# Altium project rcm3dev.PrjPCB
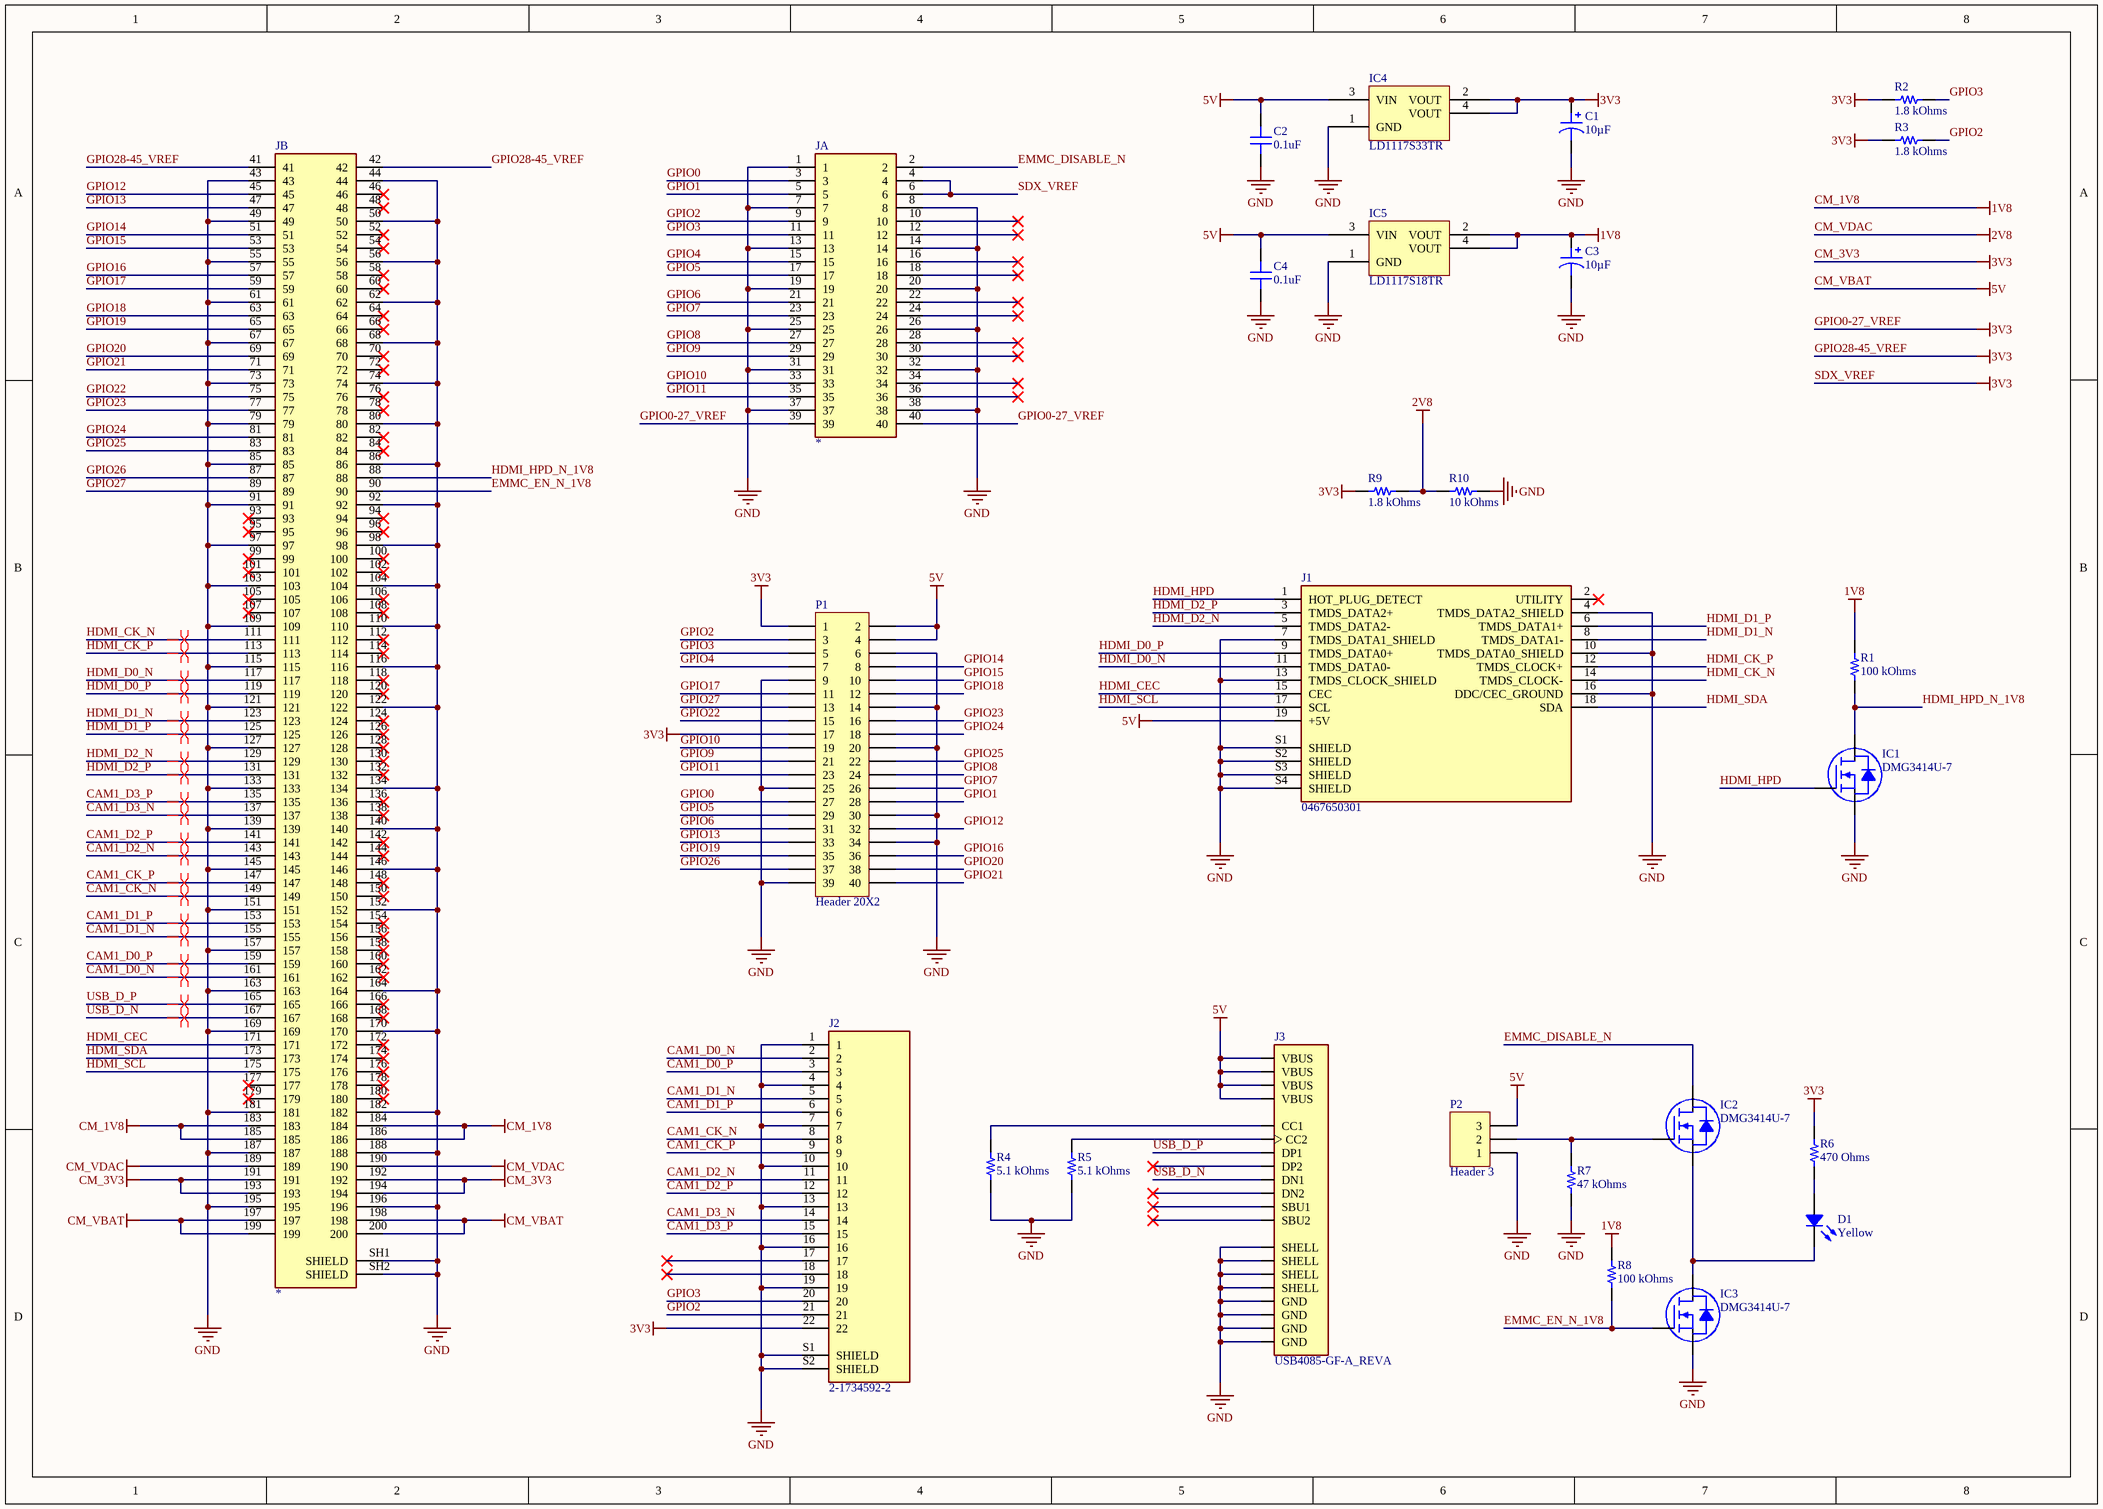
[diagram p0: Sheet.SchDoc]
1 sheet, 26 parts. Net scope: global (net labels, ports and power ports of the same name join across sheets).
Board file: PCB.PcbDoc

## Sheet Sheet.SchDoc
size A3

### Parts
C1  10µF  [CAP POL 1206_3216]
C2  0.1uF  [CAP 0603_1608]
C3  10µF  [CAP POL 1206_3216]
C4  0.1uF  [CAP 0603_1608]
D1  Yellow  [LED 0603_1608 YELLOW]
IC1  DMG3414U-7  [DIODES SOT-23-3]
IC2  DMG3414U-7  [DIODES SOT-23-3]
IC3  DMG3414U-7  [DIODES SOT-23-3]
IC4  LD1117S33TR  [ST SOT-223]
IC5  LD1117S18TR  [ST SOT-223]
J  1473149-4  [TE_1473149-4]  (value not drawn)  (parts A,B of 2)
J1  0467650301  [MOLEX_0467650301]
J2  2-1734592-2  [TE_2-1734592-2]
J3  USB4085-GF-A_REVA  [GCT_USB4085-GF-A_REVA]
P1  Header 20X2  [HDR2X20]
P2  Header 3  [HDR1X3]
R1  100 kOhms  [RES 0603_1608]
R2  1.8 kOhms  [RES 0603_1608]
R3  1.8 kOhms  [RES 0603_1608]
R4  5.1 kOhms  [RES 0603_1608]
R5  5.1 kOhms  [RES 0603_1608]
R6  470 Ohms  [RES 0603_1608]
R7  47 kOhms  [RES 0603_1608]
R8  100 kOhms  [RES 0603_1608]
R9  1.8 kOhms  [RES 0603_1608]
R10  10 kOhms  [RES 0603_1608]

### Nets
CM_1V8: C3.1 IC5.2(VOUT) IC5.4(VOUT) J.183 J.184 J.185 J.186 R1.2 R8.2  [also labelled 1V8]
CM_3V3: C1.1 IC4.2(VOUT) IC4.4(VOUT) J.4 J.6 J.39 J.40 J.41 J.42 J.191 J.192 J.193 J.194 J2.22 P1.1 P1.17 R2.1 R3.1 R6.2 R9.2  [also labelled 3V3, GPIO0-27_VREF, GPIO28-45_VREF, SDX_VREF]
CM_VBAT: C2.2 C4.2 IC4.3(VIN) IC5.3(VIN) J.197 J.198 J.199 J.200 J1.19(+5V) J3.A4(VBUS) J3.A9(VBUS) J3.B4(VBUS) J3.B9(VBUS) P1.2 P1.4 P2.3  [also labelled 5V]
CM_VDAC: J.189 J.190 R9.1 R10.2  [also labelled 2V8]
GND: C1.2 C2.1 C3.2 C4.1 IC1.2(S) IC3.2(S) IC4.1(GND) IC5.1(GND) J.1 J.7 J.8 J.13 J.14 J.19 J.20 J.25 J.26 J.31 J.32 J.37 J.38 J.43 J.44 J.49 J.50 J.55 J.56 J.61 J.62 J.67 J.68 J.73 J.74 J.79 J.80 J.85 J.86 J.91 J.92 J.97 J.98 J.103 J.104 J.109 J.110 J.115 J.116 J.121 J.122 J.127 J.133 J.134 J.139 J.140 J.145 J.146 J.151 J.152 J.157 J.163 J.164 J.169 J.170 J.181 J.182 J.187 J.188 J.195 J.196 J.SH1(SHIELD) J.SH2(SHIELD) J1.4(TMDS_DATA2_SHIELD) J1.7(TMDS_DATA1_SHIELD) J1.10(TMDS_DATA0_SHIELD) J1.13(TMDS_CLOCK_SHIELD) J1.16(DDC/CEC_GROUND) J1.S1(SHIELD) J1.S2(SHIELD) J1.S3(SHIELD) J1.S4(SHIELD) J2.1 J2.4 J2.7 J2.10 J2.13 J2.16 J2.19 J2.S1(SHIELD) J2.S2(SHIELD) J3.A1(GND) J3.A12(GND) J3.B1(GND) J3.B12(GND) J3.P1(SHELL) J3.P2(SHELL) J3.P3(SHELL) J3.P4(SHELL) P1.6 P1.9 P1.14 P1.20 P1.25 P1.30 P1.34 P1.39 P2.1 R4.1 R5.1 R7.1 R10.1
CAM1_CK_N: J.149 J2.8
CAM1_CK_P: J.147 J2.9
CAM1_D0_N: J.161 J2.2
CAM1_D0_P: J.159 J2.3
CAM1_D1_N: J.155 J2.5
CAM1_D1_P: J.153 J2.6
CAM1_D2_N: J.143 J2.11
CAM1_D2_P: J.141 J2.12
CAM1_D3_N: J.137 J2.14
CAM1_D3_P: J.135 J2.15
EMMC_DISABLE_N: IC2.3(D) J.2
EMMC_EN_N_1V8: IC3.1(G) J.90 R8.1
GPIO0: J.3 P1.27
GPIO1: J.5 P1.28
GPIO2: J.9 J2.21 P1.3 R3.2
GPIO3: J.11 J2.20 P1.5 R2.2
GPIO4: J.15 P1.7
GPIO5: J.17 P1.29
GPIO6: J.21 P1.31
GPIO7: J.23 P1.26
GPIO8: J.27 P1.24
GPIO9: J.29 P1.21
GPIO10: J.33 P1.19
GPIO11: J.35 P1.23
GPIO12: J.45 P1.32
GPIO13: J.47 P1.33
GPIO14: J.51 P1.8
GPIO15: J.53 P1.10
GPIO16: J.57 P1.36
GPIO17: J.59 P1.11
GPIO18: J.63 P1.12
GPIO19: J.65 P1.35
GPIO20: J.69 P1.38
GPIO21: J.71 P1.40
GPIO22: J.75 P1.15
GPIO23: J.77 P1.16
GPIO24: J.81 P1.18
GPIO25: J.83 P1.22
GPIO26: J.87 P1.37
GPIO27: J.89 P1.13
HDMI_CEC: J.171 J1.15(CEC)
HDMI_CK_N: J.111 J1.14(TMDS_CLOCK-)
HDMI_CK_P: J.113 J1.12(TMDS_CLOCK+)
HDMI_D0_N: J.117 J1.11(TMDS_DATA0-)
HDMI_D0_P: J.119 J1.9(TMDS_DATA0+)
HDMI_D1_N: J.123 J1.8(TMDS_DATA1-)
HDMI_D1_P: J.125 J1.6(TMDS_DATA1+)
HDMI_D2_N: J.129 J1.5(TMDS_DATA2-)
HDMI_D2_P: J.131 J1.3(TMDS_DATA2+)
HDMI_HPD: IC1.1(G) J1.1(HOT_PLUG_DETECT)
HDMI_HPD_N_1V8: IC1.3(D) J.88 R1.1
HDMI_SCL: J.175 J1.17(SCL)
HDMI_SDA: J.173 J1.18(SDA)
USB_D_N: J.167 J3.A7(DN1)
USB_D_P: J.165 J3.A6(DP1)
NetD1_1: D1.1 R6.1
NetD1_2: D1.2 IC2.2(S) IC3.3(D)
NetIC2_1: IC2.1(G) P2.2 R7.2
NetJ3_A5: J3.A5(CC1) R4.2
NetJ3_B5: J3.B5(CC2) R5.2

Not connected (* = marked no-connect by the designer): J 10* 12* 16* 18* 22* 24* 28* 30* 34* 36* 46* 48* 52* 54* 58* 60* 64* 66* 70* 72* 76* 78* 82* 84* 93* 94* 95* 96* 99* 100* 101* 102* 105* 106* 107* 108* 112* 114* 118* 120* 124* 126* 128* 130* 132* 136* 138* 142* 144* 148* 150* 154* 156* 158* 160* 162* 166* 168* 172* 174* 176* 177* 178* 179* 180*; J1 2(UTILITY)*; J2 17* 18*; J3 A8(SBU1)* B6(DP2)* B7(DN2)* B8(SBU2)*

### Layout directives
differential pair: CAM1_CK_N, CAM1_CK_P, CAM1_D0_N, CAM1_D0_P, CAM1_D1_N, CAM1_D1_P, CAM1_D2_N, CAM1_D2_P, CAM1_D3_N, CAM1_D3_P, HDMI_CK_N, HDMI_CK_P, HDMI_D0_N, HDMI_D0_P, HDMI_D1_N, HDMI_D1_P, HDMI_D2_N, HDMI_D2_P, USB_D_N, USB_D_P

### Library data of the parts
C1 C3 = TR3A475K020C1800: CAP TANT 4.7UF 10% 20V 1206; Manufacturer: Vishay Sprague; Manufacturer Size Code: A; Capacitance: 4.7µF; ESR (Equivalent Series Resistance): 1.8Ohm; Type: Molded; Part Number: TR3A475K020C1800; Value: 10µF; ComponentLink1Description: Datasheet; ComponentLink1URL: http://www.vishay.com/docs/40080/tr3.pdf; ComponentLink2Description: DigiKey Link; ComponentLink2URL: http://digikey.com/product-detail/en/vishay-sprague/TR3A475K020C1800/718-1830-1-ND/2259990; Device Package: 1206 (3216 Metric); Features: General Purpose; Height - Seated (Max): 0.071" (1.80mm); LastUpdated: 02-09-2020 1.15.59 AM; Lifecycle Status: Active; Minimum Order: 1; Mounting Type: Surface Mount; Operating Temperature: -55°C ~ 125°C; Package / Case: 1206 (3216 Metric); Packaging: TapeAndReel; PartId: 139; Part Status: Active; Price: 0.35; Series: TANTAMOUNT®, TR3; Size / Dimension: 0.126" L x 0.063" W (3.20mm x 1.60mm); Supplier 1: DigiKey; Supplier Part Number 1: 718-1830-1-ND; Tolerance: ±10%; Voltage - Rated: 20V
C2 C4 = CC0603KRX7RABB102: CAP CER 0.1uF 200V X7R 0603; Manufacturer: Yageo; Capacitance: 1000pF; Tolerance: ±10%; Part Number: CC0603KRX7RABB102; Value: 0.1uF; Applications: General Purpose; ComponentLink1Description: Datasheet; ComponentLink1URL: http://www.yageo.com/documents/recent/UPY-NP0X7R_MV_100-to-630V_21.pdf; ComponentLink2Description: DigiKey Link; ComponentLink2URL: http://digikey.com/product-detail/en/yageo/CC0603KRX7RABB102/311-4103-1-ND/8025192; Device Package: 0603 (1608 Metric); LastUpdated: 02-09-2020 1.03.36 AM; Lifecycle Status: Active; Minimum Order: 1; Mounting Type: Surface Mount, MLCC; Operating Temperature: -55°C ~ 125°C; Package / Case: 0603 (1608 Metric); Packaging: TapeAndReel; PartId: 2225; Part Status: Active; Price: 0.02; Series: CC; Size / Dimension: 0.063" L x 0.031" W (1.60mm x 0.80mm); Supplier 1: DigiKey; Supplier Part Number 1: 311-4103-1-ND; Temperature Coefficient: X7R; Thickness (Max): 0.035" (0.90mm); Voltage - Rated: 200V
D1 = FKY1111C-TR: LED YELLOW DIFFUSED SMD; Manufacturer: Stanley Electric Co; Configuration: Standard; Current - Test: 20mA; Lens Color: White; Lens Size: 1.20mm x 0.80mm; Lens Style: Rectangle with Flat Top; Millicandela Rating: 270mcd; Voltage - Forward (Vf) (Typ): 2.1V; Wavelength - Dominant: 589nm; Wavelength - Peak: 592nm; Part Number: FKY1111C-TR; Color: Yellow; ComponentLink1Description: Datasheet; ComponentLink1URL: http://www.stanley-components.com/php/downloaddatafile.php?rp=0,FKY1111C-TR_e.pdf; ComponentLink2Description: DigiKey Link; ComponentLink2URL: http://digikey.com/product-detail/en/stanley-electric-co/FKY1111C-TR/404-1273-1-ND/9477278; Device Package: 0603 (1608 Metric); Height (Max): 0.80mm; LastUpdated: 02-09-2020 1.21.17 AM; Lens Transparency: Diffused; Lifecycle Status: Active; Minimum Order: 1; Mounting Type: Surface Mount; Package / Case: 0603 (1608 Metric); Packaging: TapeAndReel; PartId: 154; Part Status: Active; Price: 0.11; Series: 1111C; Size / Dimension: 1.60mm L x 0.80mm W; Supplier 1: DigiKey; Supplier Part Number 1: 404-1273-1-ND; Supplier Device Package: 1608; Value: Yellow
IC1-IC3 = DMG3414U-7: MOSFET N-CH 20V 4.2A SOT23; Manufacturer: Diodes Incorporated; Current - Continuous Drain (Id) @ 25°C: 4.2A (Ta); Drive Voltage (Max Rds On,  Min Rds On): 1.8V, 4.5V; FET Type: N-Channel; Gate Charge (Qg) (Max) @ Vgs: 9.6nC @ 4.5V; Input Capacitance (Ciss) (Max) @ Vds: 829.9pF @ 10V; Power Dissipation (Max): 780mW (Ta); Rds On (Max) @ Id, Vgs: 25mOhm @ 8.2A, 4.5V; Vgs (Max): ±8V; Vgs(th) (Max) @ Id: 900mV @ 250µA; Part Number: DMG3414U-7; ComponentLink1Description: Datasheet; ComponentLink1URL: https://www.diodes.com/assets/Datasheets/ds31739.pdf; ComponentLink2Description: DigiKey Link; ComponentLink2URL: http://digikey.com/product-detail/en/diodes-incorporated/DMG3414U-7/DMG3414U-7DICT-ND/2183251; Drain to Source Voltage (Vdss): 20V; LastUpdated: 02-09-2020 1.25.02 AM; Lifecycle Status: Active; Minimum Order: 1; Mounting Type: Surface Mount; Operating Temperature: -55°C ~ 150°C (TJ); Package / Case: TO-236-3, SC-59, SOT-23-3; Packaging: TapeAndReel; Part Status: Active; Price: 0.16; Series: -; Supplier 1: DigiKey; Supplier Part Number 1: DMG3414U-7DICT-ND; Supplier Device Package: SOT-23-3; Technology: MOSFET (Metal Oxide)
IC4 = LD1117S33TR: IC REG LINEAR 3.3V 800MA SOT223; Manufacturer: STMicroelectronics; Current - Quiescent (Iq): 10mA; Number of Regulators: 1; Output Configuration: Positive; Output Type: Fixed; Protection Features: Over Current, Over Temperature; PSRR: 75dB (120Hz); Voltage Dropout (Max): 1.2V @ 800mA; Voltage - Input (Max): 15V; Part Number: LD1117S33TR; ComponentLink1Description: Datasheet; ComponentLink1URL: http://www.st.com/content/ccc/resource/technical/document/datasheet/99/3b/7d/91/91/51/4b/be/CD00000544.pdf/files/CD00000544.pdf/jcr:content/translations/en.CD00000544.pdf; ComponentLink2Description: DigiKey Link; ComponentLink2URL: http://digikey.com/product-detail/en/stmicroelectronics/LD1117S33TR/497-1242-1-ND/586242; Current - Output: 800mA; LastUpdated: 02-09-2020 1.24.39 AM; Lifecycle Status: Active; Minimum Order: 1; Mounting Type: Surface Mount; Package / Case: TO-261-4, TO-261AA; Packaging: TapeAndReel; Part Status: Active; Price: 0.14; Series: -; Supplier 1: DigiKey; Supplier Part Number 1: 497-1242-1-ND; Supplier Device Package: SOT-223; Voltage - Output (Min/Fixed): 3.3V
IC5 = LD1117S18TR: IC REG LINEAR 1.8V 800MA SOT223; Manufacturer: STMicroelectronics; Current - Quiescent (Iq): 10mA; Number of Regulators: 1; Output Configuration: Positive; Output Type: Fixed; Protection Features: Over Current, Over Temperature; PSRR: 75dB (120Hz); Voltage Dropout (Max): 1.2V @ 800mA; Voltage - Input (Max): 15V; Part Number: LD1117S18TR; ComponentLink1Description: Datasheet; ComponentLink1URL: http://www.st.com/content/ccc/resource/technical/document/datasheet/99/3b/7d/91/91/51/4b/be/CD00000544.pdf/files/CD00000544.pdf/jcr:content/translations/en.CD00000544.pdf; ComponentLink2Description: DigiKey Link; ComponentLink2URL: http://digikey.com/product-detail/en/stmicroelectronics/LD1117S18TR/497-7308-1-ND/1883983; Current - Output: 800mA; LastUpdated: 02-09-2020 1.24.39 AM; Lifecycle Status: Active; Minimum Order: 1; Mounting Type: Surface Mount; Package / Case: TO-261-4, TO-261AA; Packaging: TapeAndReel; Part Status: Active; Price: 0.19; Series: -; Supplier 1: DigiKey; Supplier Part Number 1: 497-7308-1-ND; Supplier Device Package: SOT-223; Voltage - Output (Min/Fixed): 1.8V
J = 1473149-4: 200 Position Dual Row 0.60mm Surface Mount Right Angle DIMM Memory Socket; Centerline_Pitch: .6 mm[.024 in]; MF: TE Connectivity; Number_of_Positions: 200; Package: None; Value: *; Availability: Unavailable; SnapEDA_Link: https://www.snapeda.com/parts/1473149-4/TE%20Connectivity%20AMP%20Connectors/view-part/798476/?ref=snap; Price: None; MP: 1473149-4; Product_Type: Socket; TE_purchase_URL: https://www.te.com/usa-en/product-1473149-4.html?te_bu=Cor&te_type=disp&te_campaign=seda_glo_cor-seda-global-disp-prtnr-fy19-seda-model-bom-cta_sma-317_1&elqCampaignId=32493; Comment_1: *
J1 = 0467650301: HDMI - Micro Receptacle Connector 19 Position Surface Mount, Right Angle; MF: Molex; Value: *; Package: None; Price: None; MP: 0467650301; SnapEDA_Link: https://www.snapeda.com/parts/0467650301/Molex/view-part/2155824/?ref=snap; Availability: Unavailable
J2 = 2-1734592-2: 22 Position FPC Connector Contacts, Bottom 0.020 _0.50mm_ Surface Mount, Right Angle; MF: TE Connectivity; Price: None; SnapEDA_Link: https://www.snapeda.com/parts/2-1734592-2/TE%20Connectivity/view-part/4788509/?ref=snap; Availability: Unavailable; Value: *; MP: 2-1734592-2; TE_purchase_URL: https://www.te.com/usa-en/product-2-1734592-2.html?te_bu=Cor&te_type=disp&te_campaign=seda_glo_cor-seda-global-disp-prtnr-fy19-seda-model-bom-cta_sma-317_1&elqCampaignId=32493; Package: None
J3 = USB4085-GF-A_REVA: USB-C (USB TYPE-C) USB 2.0 Receptacle Connector 24 (16+8 Dummy) Position Through Hole, Right Angle; MF: Global Connector Technology; Purchase-URL: https://pricing.snapeda.com/search/part/USB4085-GF-A/?ref=eda; SnapEDA_Link: https://www.snapeda.com/parts/USB4085-GF-A/Global%20Connector%20Technology/view-part/2780390/?ref=snap; Check_prices: https://www.snapeda.com/parts/USB4085-GF-A/Global%20Connector%20Technology/view-part/2780390/?ref=eda; Value: *; MP: USB4085-GF-A; Package: Package; Price: None; Availability: Warning
P1 = Header 20X2: Header, 20-Pin, Dual row; LatestRevisionDate: 17-Jul-2002; LatestRevisionNote: Re-released for DXP Platform.; Publisher: Altium Limited
P2 = Header 3: Header, 3-Pin; LatestRevisionDate: 17-Jul-2002; LatestRevisionNote: Re-released for DXP Platform.; Publisher: Altium Limited
R1 R8 = RNCS0603BKE100K: RES 100K OHM 0.1% 1/16W 0603; Manufacturer: Stackpole Electronics Inc; Power (Watts): 0.063W, 1/16W; Temperature Coefficient: ±25ppm/°C; Part Number: RNCS0603BKE100K; Value: 100 kOhms; ComponentLink1Description: Datasheet; ComponentLink1URL: https://www.seielect.com/catalog/sei-rncs_rnch.pdf; ComponentLink2Description: DigiKey Link; ComponentLink2URL: http://digikey.com/product-detail/en/stackpole-electronics-inc/RNCS0603BKE100K/RNCS0603BKE100KCT-ND/1800112; Composition: Thin Film; Device Package: 0603 (1608 Metric); Features: Anti-Corrosive, Automotive AEC-Q200, Moisture Resistant; Height - Seated (Max): 0.022" (0.55mm); LastUpdated: 02-09-2020 1.10.25 AM; Lifecycle Status: Active; Minimum Order: 1; Number of Terminations: 2; Operating Temperature: -55°C ~ 155°C; Package / Case: 0603 (1608 Metric); Packaging: TapeAndReel; PartId: 4849; Part Status: Active; Price: 0.08; Ratings: AEC-Q200; Resistance: 100 kOhms; Series: RNCS; Size / Dimension: 0.061" L x 0.031" W (1.55mm x 0.80mm); Supplier 1: DigiKey; Supplier Part Number 1: RNCS0603BKE100KCT-ND; Supplier Device Package: 0603; Tolerance: ±0.1%
R2 R3 R9 = RMCF0603JT1K80: RES 1.8K OHM 5% 1/10W 0603; Manufacturer: Stackpole Electronics Inc; Power (Watts): 0.1W, 1/10W; Temperature Coefficient: ±200ppm/°C; Part Number: RMCF0603JT1K80; Value: 1.8 kOhms; ComponentLink1Description: Datasheet; ComponentLink1URL: https://www.seielect.com/catalog/sei-rmcf_rmcp.pdf; ComponentLink2Description: DigiKey Link; ComponentLink2URL: http://digikey.com/product-detail/en/stackpole-electronics-inc/RMCF0603JT1K80/RMCF0603JT1K80CT-ND/1943176; Composition: Thick Film; Device Package: 0603 (1608 Metric); Features: Automotive AEC-Q200; Height - Seated (Max): 0.022" (0.55mm); LastUpdated: 02-09-2020 1.10.23 AM; Lifecycle Status: Active; Minimum Order: 1; Number of Terminations: 2; Operating Temperature: -55°C ~ 155°C; Package / Case: 0603 (1608 Metric); Packaging: CutTape; PartId: 5907; Part Status: Active; Price: 0.10; Ratings: AEC-Q200; Resistance: 1.8 kOhms; Series: RMCF; Size / Dimension: 0.061" L x 0.031" W (1.55mm x 0.80mm); Supplier 1: DigiKey; Supplier Part Number 1: RMCF0603JT1K80CT-ND; Supplier Device Package: 0603; Tolerance: ±5%
R4 R5 = RMCF0603JG5K10: RES 5.1K OHM 5% 1/10W 0603; Manufacturer: Stackpole Electronics Inc; Power (Watts): 0.1W, 1/10W; Temperature Coefficient: ±200ppm/°C; Part Number: RMCF0603JG5K10; Value: 5.1 kOhms; ComponentLink1Description: Datasheet; ComponentLink1URL: https://www.seielect.com/catalog/sei-packaging.pdf; ComponentLink2Description: DigiKey Link; ComponentLink2URL: http://digikey.com/product-detail/en/stackpole-electronics-inc/RMCF0603JG5K10/RMCF0603JG5K10CT-ND/4425135; Composition: Thick Film; Device Package: 0603 (1608 Metric); Features: Automotive AEC-Q200; Height - Seated (Max): 0.022" (0.55mm); LastUpdated: 02-09-2020 1.10.24 AM; Lifecycle Status: Active; Minimum Order: 1; Number of Terminations: 2; Operating Temperature: -55°C ~ 155°C; Package / Case: 0603 (1608 Metric); Packaging: CutTape; PartId: 5180; Part Status: Active; Price: 0.10; Ratings: AEC-Q200; Resistance: 5.1 kOhms; Series: RMCF; Size / Dimension: 0.061" L x 0.031" W (1.55mm x 0.80mm); Supplier 1: DigiKey; Supplier Part Number 1: RMCF0603JG5K10CT-ND; Supplier Device Package: 0603; Tolerance: ±5%
R6 = RMCF0603FT470R: RES 470 OHM 1% 1/10W 0603; Manufacturer: Stackpole Electronics Inc; Power (Watts): 0.1W, 1/10W; Temperature Coefficient: ±100ppm/°C; Part Number: RMCF0603FT470R; Value: 470 Ohms; ComponentLink1Description: Datasheet; ComponentLink1URL: https://www.seielect.com/catalog/sei-rmcf_rmcp.pdf; ComponentLink2Description: DigiKey Link; ComponentLink2URL: http://digikey.com/product-detail/en/stackpole-electronics-inc/RMCF0603FT470R/RMCF0603FT470RCT-ND/1942986; Composition: Thick Film; Device Package: 0603 (1608 Metric); Features: Automotive AEC-Q200; Height - Seated (Max): 0.022" (0.55mm); LastUpdated: 02-09-2020 1.10.22 AM; Lifecycle Status: Active; Minimum Order: 1; Number of Terminations: 2; Operating Temperature: -55°C ~ 155°C; Package / Case: 0603 (1608 Metric); Packaging: CutTape; PartId: 6081; Part Status: Active; Price: 0.10; Ratings: AEC-Q200; Resistance: 470 Ohms; Series: RMCF; Size / Dimension: 0.061" L x 0.031" W (1.55mm x 0.80mm); Supplier 1: DigiKey; Supplier Part Number 1: RMCF0603FT470RCT-ND; Supplier Device Package: 0603; Tolerance: ±1%
R7 = CPF0603B47KE: RES SMD 47K OHM 0.1% 1/16W 0603; Manufacturer: TE Connectivity Passive Product; Power (Watts): 0.063W, 1/16W; Temperature Coefficient: ±25ppm/°C; Part Number: CPF0603B47KE; Value: 47 kOhms; ComponentLink1Description: Datasheet; ComponentLink1URL: https://www.te.com/commerce/DocumentDelivery/DDEController?Action=srchrtrv&DocNm=1773200&DocType=DS&DocLang=English; ComponentLink2Description: DigiKey Link; ComponentLink2URL: http://digikey.com/product-detail/en/te-connectivity-passive-product/CPF0603B47KE/A119911CT-ND/4966509; Composition: Thin Film; Device Package: 0603 (1608 Metric); Height - Seated (Max): 0.022" (0.55mm); LastUpdated: 02-09-2020 1.10.16 AM; Lifecycle Status: Active; Minimum Order: 1; Number of Terminations: 2; Operating Temperature: -55°C ~ 155°C; Package / Case: 0603 (1608 Metric); Packaging: TapeAndReel; PartId: 9346; Part Status: Active; Price: 0.09; Resistance: 47 kOhms; Series: CPF, Neohm; Size / Dimension: 0.061" L x 0.031" W (1.55mm x 0.80mm); Supplier 1: DigiKey; Supplier Part Number 1: A119911CT-ND; Supplier Device Package: 0603; Tolerance: ±0.1%
R10 = RNCS0603BKE10K0: RES 10K OHM 0.1% 1/16W 0603; Manufacturer: Stackpole Electronics Inc; Power (Watts): 0.063W, 1/16W; Temperature Coefficient: ±25ppm/°C; Part Number: RNCS0603BKE10K0; Value: 10 kOhms; ComponentLink1Description: Datasheet; ComponentLink1URL: https://www.seielect.com/catalog/sei-rncs_rnch.pdf; ComponentLink2Description: DigiKey Link; ComponentLink2URL: http://digikey.com/product-detail/en/stackpole-electronics-inc/RNCS0603BKE10K0/RNCS0603BKE10K0CT-ND/1800113; Composition: Thin Film; Device Package: 0603 (1608 Metric); Features: Anti-Corrosive, Automotive AEC-Q200, Moisture Resistant; Height - Seated (Max): 0.022" (0.55mm); LastUpdated: 02-09-2020 1.10.25 AM; Lifecycle Status: Active; Minimum Order: 1; Number of Terminations: 2; Operating Temperature: -55°C ~ 155°C; Package / Case: 0603 (1608 Metric); Packaging: TapeAndReel; PartId: 4838; Part Status: Active; Price: 0.08; Ratings: AEC-Q200; Resistance: 10 kOhms; Series: RNCS; Size / Dimension: 0.061" L x 0.031" W (1.55mm x 0.80mm); Supplier 1: DigiKey; Supplier Part Number 1: RNCS0603BKE10K0CT-ND; Supplier Device Package: 0603; Tolerance: ±0.1%